# Altium schematic sheet T35_7_MEMORY.SchDoc
size A4
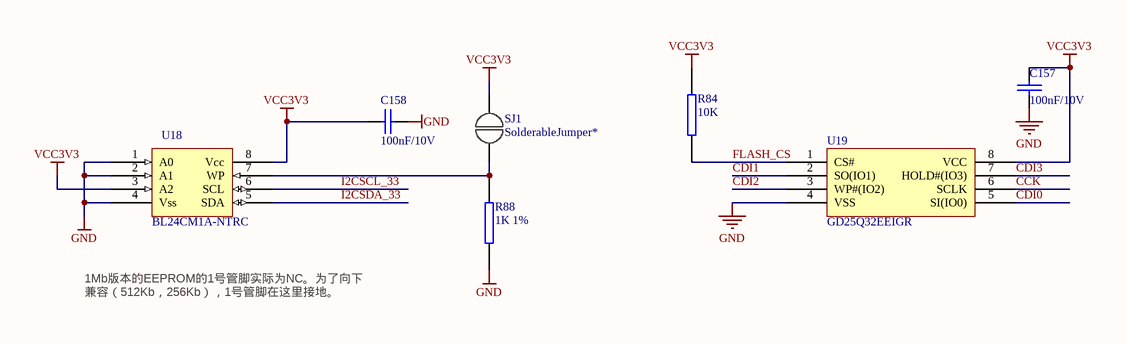
[diagram p0: T35_7_MEMORY.SchDoc]

## Parts
C157  100nF/10V  [0201CS]
C158  100nF/10V  [0201CS]
R84  10K  [0201RS]
R88  1K 1%  [0402RS]
SJ1  SolderableJumper*  [SJ]
U18  BL24CM1A-NTRC  [UDFN-8LL]
U19  GD25Q32EEIGR  [SON127P600-8N-USON8]

## Nets
GND: C157.2 C158.1 R88.2 U18.1(A0) U18.2(A1) U18.4(Vss) U19.4(VSS)
VCC3V3: C157.1 C158.2 R84.2 SJ1.1 U18.3(A2) U18.8(Vcc) U19.8(VCC)
CCK: U19.6(SCLK)
CDI0: U19.5(SI(IO0))
CDI1: U19.2(SO(IO1))
CDI2: U19.3(WP#(IO2))
CDI3: U19.7(HOLD#(IO3))
FLASH_CS: R84.1 U19.1(CS#)
I2CSCL_33: U18.6(SCL)
I2CSDA_33: U18.5(SDA)
NetR88_1: R88.1 SJ1.2 U18.7(WP)

## Notes on the sheet
- 1Mb版本的EEPROM的1号管脚实际为NC。为了向下兼容（512Kb，256Kb），1号管脚在这里接地。

## Library data of the parts
C157 = CAP: 贴片电容; Value: 0.1uF ±10% 16V; Link: https://item.szlcsc.com/456838.html
C158 = CAP: 贴片电容; Link: https://item.szlcsc.com/456838.html
R84 R88 = RES2: 贴片电阻
SJ1 = SolderableJumper
U18 = 24LC00: EEPROM芯片; Text Field1: 60; Text Field2: 50
U19 = GD25Q64ESIG: SPI Flash